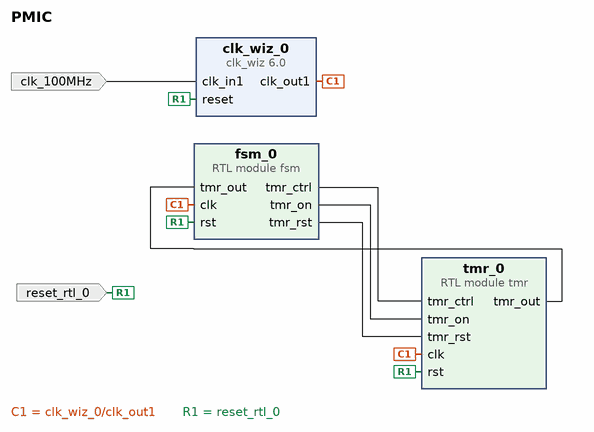
[diagram p0: block diagram of the top level]
# Vivado block design PMIC, xc7a35tcpg236-1, Vivado 2022.1.2
create_bd_design PMIC

create_bd_port -dir I -type clk clk_100MHz
set_property -dict {CONFIG.FREQ_HZ 100000000} [get_bd_ports clk_100MHz]
create_bd_port -dir I -type rst reset_rtl_0
set_property -dict {CONFIG.POLARITY ACTIVE_HIGH} [get_bd_ports reset_rtl_0]

create_bd_cell -type ip -vlnv xilinx.com:ip:clk_wiz:6.0 clk_wiz_0
create_bd_cell -type module -reference fsm fsm_0
create_bd_cell -type module -reference tmr tmr_0

# ---- connections ----

connect_bd_net [get_bd_ports clk_100MHz] [get_bd_pins clk_wiz_0/clk_in1]
connect_bd_net [get_bd_pins clk_wiz_0/clk_out1] [get_bd_pins fsm_0/clk] [get_bd_pins tmr_0/clk]
connect_bd_net [get_bd_pins fsm_0/tmr_ctrl] [get_bd_pins tmr_0/tmr_ctrl]
connect_bd_net [get_bd_pins fsm_0/tmr_on] [get_bd_pins tmr_0/tmr_on]
connect_bd_net [get_bd_pins fsm_0/tmr_rst] [get_bd_pins tmr_0/tmr_rst]
connect_bd_net -net reset_rtl_0_1 [get_bd_ports reset_rtl_0] [get_bd_pins clk_wiz_0/reset] [get_bd_pins fsm_0/rst] [get_bd_pins tmr_0/rst]
connect_bd_net [get_bd_pins tmr_0/tmr_out] [get_bd_pins fsm_0/tmr_out]

validate_bd_design
save_bd_design
